# Altium schematic sheet Supply.SchDoc
size A4
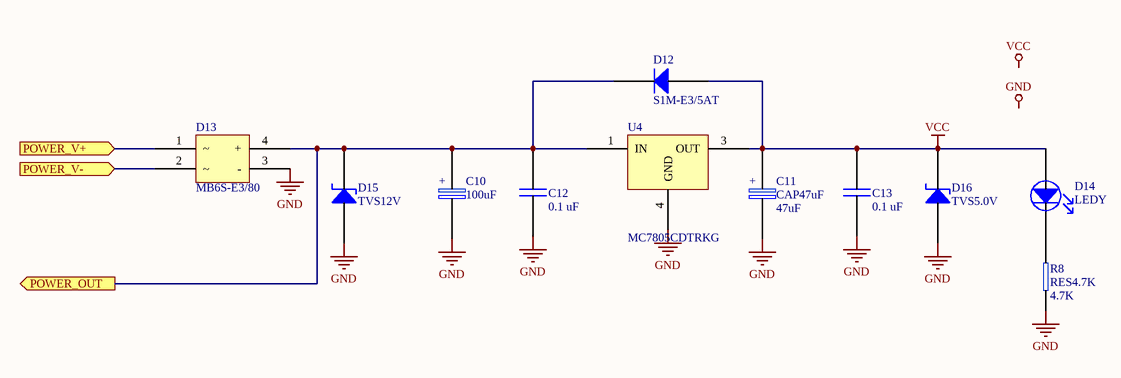
[diagram p0: Supply.SchDoc]

## Parts
C10  value 100uF  [EEH-ZA1E101XP]  (hidden comment: CAP100uF)
C11  CAP47uF  value 47uF  [EEH-ZA1E101XP]
C12  value 0.1 uF  [CAP0603]  (hidden comment: CAP0.1uF)
C13  value 0.1 uF  [CAP0603]  (hidden comment: CAP0.1uF)
D12  S1M-E3/5AT  [S1M-E3/5AT]
D13  MB6S-E3/80  [MB6S-E3/80]
D14  LEDY  [150060YS75000]
D15  TVS12V  [SMBJ5.0A]
D16  TVS5.0V  [SMBJ5.0A]
R8  RES4.7K  value 4.7K  [RES0603]
U4  MC7805CDTRKG  [MC7805CDTRKG]

## Ports
POWER_OUT (out), POWER_V+ (in), POWER_V- (in)

## Nets
GND: C10.2(neg) C11.2(neg) C12.2 C13.2 D13.3(-) D15.2(Anode) D16.2(Anode) R8.2(neg) U4.4(GND)
VCC: C11.1(pos) C13.1 D12.2(Anode) D14.2(Anode) D16.1(Cathode) U4.3(OUT)
POWER_OUT: C10.1(pos) C12.1 D12.1(Cathode) D13.4(+) D15.1(Cathode) U4.1(IN) ; port POWER_OUT
POWER_V+: D13.1 ; port POWER_V+
POWER_V-: D13.2 ; port POWER_V-
NetD14_1: D14.1(Cathode) R8.1(pos)

## Notes on the sheet
- Labels drawn without touching a wire or pin: GND, VCC
- (in symbol CAP47uF) +
- (in symbol CAP100uF) +

## Library data of the parts
C10 = CAP100uF: Capacitores de polímero orgánico de aluminio 100uF 25volts 6.3x7.7mm; Supplier: Mouser; Supplier PN: 667-EEH-ZA1E101XP; MPN: EEH-ZA1E101XP
C11 = CAP47uF: Capacitores de polímero orgánico de aluminio 25volts 47uF ESR 30mohm; MPN: 25SVPF47M; Supplier: Mouser; Supplier PN: 667-25SVPF47M
C12 C13 = C0.1UF: Capacitores cerámicos de capas múltiples (MLCC) - SMD/SMT 0603 0.1uF 16volts X7R 5%; MPN: VJ0603Y104JXJPW1BC; Supplier PN: 77-VJ0603Y104JXJPBC; Supplier: Mouser
D12 = S1M-E3/5AT: Rectificadores 1.0 Amp 1000 Volt 30A IFSM @ 8.3ms; Value: 1A; Supplier: Mouser; Supplier PN: 625-S1M-E3/5AT; MPN: S1M-E3/5AT
D13 = MB6S-E3/80: Rectificadores en puente 600 Volt 0.5 Amp 35 Amp IFSM; Value: 35V / 1A; MPN: MB6S-E3/80; Supplier: Mouser; Supplier PN: 625-MB6S-E3/80
D14 = LEDY: LED estándar - SMD (montaje superficial) WL-SMCW SMDMono TpVw Waterclr 0603 Yellow; Supplier: Mouser; Supplier PN: 710-150060YS75000; MPN: 150060YS75000; Value: Yellow
D15 = TVS12V: Diodos TVS - Supresores de tensión transitoria 600W 12V 5% Uni; MPN: SMBJ12A-E3/52; Supplier: Mouser; Supplier PN: 625-SMBJ12A-E3; Value: 12 V
D16 = TVS5.0V: Diodos TVS - Supresores de tensión transitoria 5Vr 600W 65.3A 5% UniDirectional; Value: 5.0 V; Supplier: Mouser; Supplier PN: 576-SMBJ5.0A; MPN: SMBJ5.0A
R8 = RES4.7K: Resistores de película gruesa - SMD 1/10watt 4.7Kohms 1%; MPN: CRCW06034K70FKEA; Supplier PN: 71-CRCW0603-4.7K-E3; Supplier: Mouser
U4 = MC7805CDTRKG: Reguladores de tensión lineal 5V 1A Postive; Value: 5.0 V / 1.0 A; Supplier: Mouser; Supplier PN: 863-MC7805CDTRKG; MPN: MC7805CDTRKG